# EAGLE schematic Scheffknecht_input_switch (EAGLE 7.7.0)
PROJEKT_NAME: Verstärker_Innovativwoche; SCH_SHEET_NAME: Input switcher; USER_NAME: Scheffknecht/Melcher-Millner
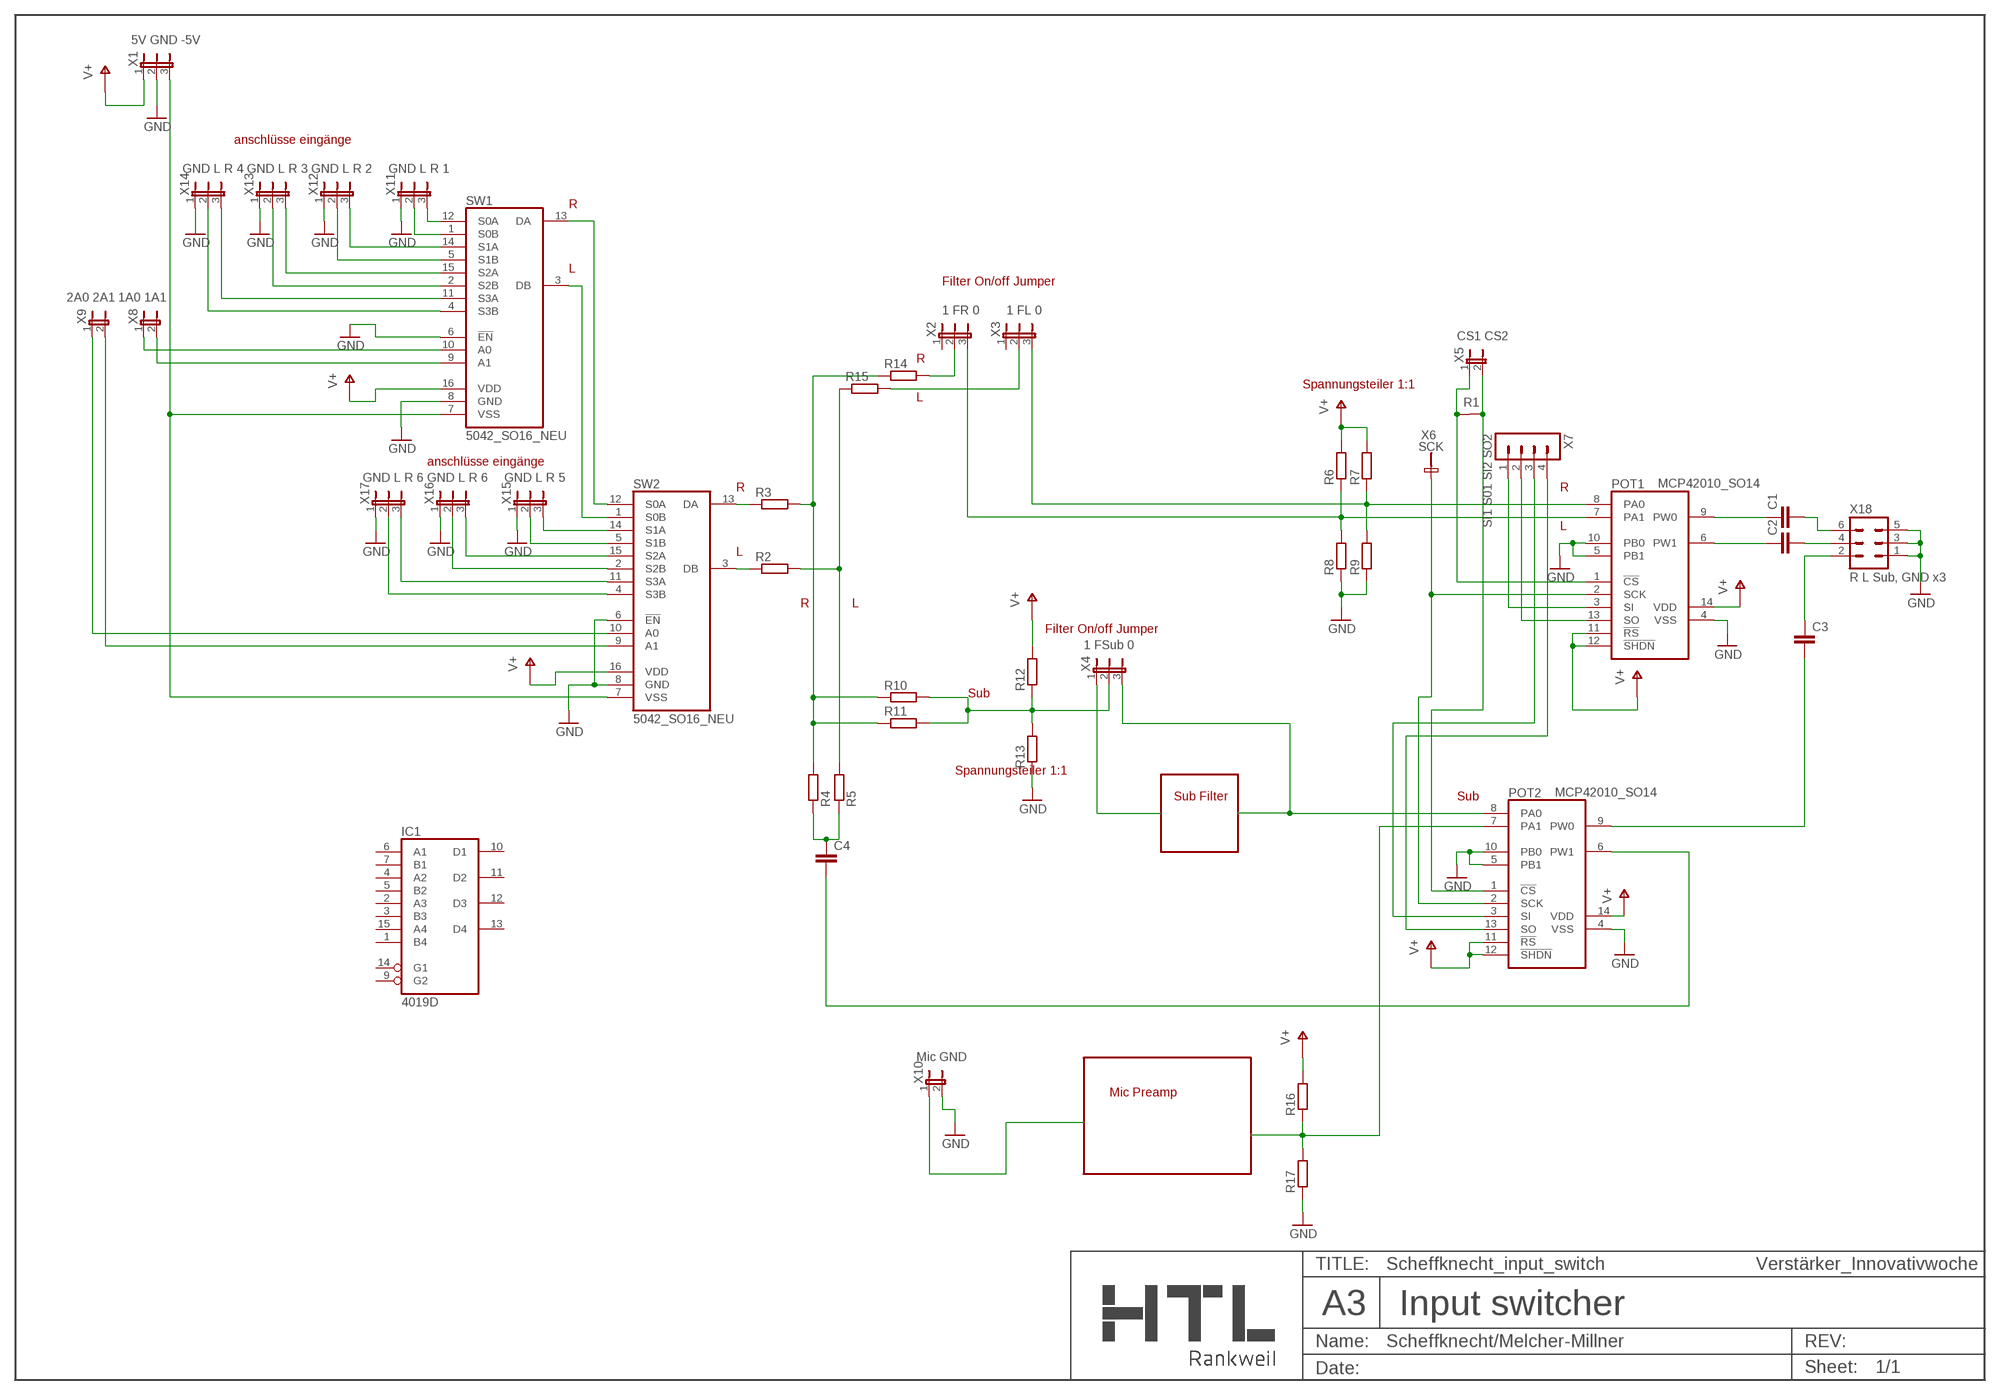
[diagram p0: schematic, sheet 1]

## Parts
C1  C-EUC0805  [C0805]
C2  C-EUC0805  [C0805]
C3  C-EUC0805  [C0805]
C4  C-EUC0805  [C0805]
FRAME1  HTL-A3-H  [HTL-LEER]
IC1  4019D  [SO16]
POT1  MCP42010_SO14  [SO14]
POT2  MCP42010_SO14  [SO14]
R1  R0/10  [R0/10]
R2  R-EU_M0805  [M0805]
R3  R-EU_M0805  [M0805]
R4  R-EU_M0805  [M0805]
R5  R-EU_M0805  [M0805]
R6  R-EU_M0805  [M0805]
R7  R-EU_M0805  [M0805]
R8  R-EU_M0805  [M0805]
R9  R-EU_M0805  [M0805]
R10  R-EU_M0805  [M0805]
R11  R-EU_M0805  [M0805]
R12  R-EU_M0805  [M0805]
R13  R-EU_M0805  [M0805]
R14  R-EU_M0805  [M0805]
R15  R-EU_M0805  [M0805]
R16  R-EU_M0805  [M0805]
R17  R-EU_M0805  [M0805]
SW1  5042_SO16_NEU  [SO-16]
SW2  5042_SO16_NEU  [SO-16]
X1  5V GND -5V  JMP3  [JMP3]
X2  1 FR 0  JMP3  [JMP3]
X3  1 FL 0  JMP3  [JMP3]
X4  1 FSub 0  JMP3  [JMP3]
X5  CS1 CS2  JMP2  [JMP2]
X6  SCK  PIN1  [PIN1]
X7  SI1 S01 SI2 SO2  MA04-1  [MA04-1]
X8  1A0 1A1  JMP2  [JMP2]
X9  2A0 2A1  JMP2  [JMP2]
X10  Mic GND  JMP2  [JMP2]
X11  GND L R 1  JMP3  [JMP3]
X12  GND L R 2  JMP3  [JMP3]
X13  GND L R 3  JMP3  [JMP3]
X14  GND L R 4  JMP3  [JMP3]
X15  GND L R 5  JMP3  [JMP3]
X16  GND L R 6  JMP3  [JMP3]
X17  GND L R 6  JMP3  [JMP3]
X18  R L Sub, GND x3  MA03-2  [MA03-2]

## Nets
GND: POT1.4(VSS) POT1.5(PB1) POT1.10(PB0) POT2.4(VSS) POT2.5(PB1) POT2.10(PB0) R8.1 R9.1 R13.1 R17.1 SW1.6(!EN) SW1.8(GND) SW2.6(!EN) SW2.8(GND) X1.2 X10.2 X11.1 X12.1 X13.1 X14.1 X15.1 X16.1 X17.1 X18.1 X18.3 X18.5
N$1: POT2.1(!CS) R1.2 X5.2
N$2: POT1.1(!CS) R1.1 X5.1
N$3: SW1.3(DB) SW2.1(S0B)
N$4: SW1.13(DA) SW2.12(S0A)
N$5: SW1.9(A1) X8.2
N$6: SW1.10(A0) X8.1
N$7: SW2.9(A1) X9.2
N$8: SW2.10(A0) X9.1
N$10: POT1.3(SI) X7.1
N$11: SW1.7(VSS) SW2.7(VSS) X1.3
N$12: R3.1 SW2.13(DA)
N$13: R2.1 SW2.3(DB)
N$14: R3.2 R4.2 R10.1 R11.1 R14.1
N$15: R2.2 R5.2 R15.1
N$16: C4.1 R4.1 R5.1
N$17: POT1.8(PA0) R7.1 R9.2 X3.3
N$18: C1.1 POT1.9(PW0)
N$20: POT1.7(PA1) R6.1 R8.2 X2.3
N$21: C1.2 X18.6
N$22: R10.2 R11.2 R12.1 R13.2 X4.2
N$23: X4.1
N$24: POT2.8(PA0) X4.3
N$25: C3.2 POT2.9(PW0)
N$26: C2.2 X18.4
N$27: C2.1 POT1.6(PW1)
N$28: C3.1 X18.2
N$31: POT1.13(SO) X7.2
N$32: POT2.3(SI) X7.3
N$33: POT2.13(SO) X7.4
N$34: C4.2 POT2.6(PW1)
N$35: X10.1
N$36: POT2.7(PA1) R16.1 R17.2
N$37: POT1.2(SCK) POT2.2(SCK) X6.P$2(KL1)
N$38: SW1.12(S0A) X11.3
N$39: SW1.1(S0B) X11.2
N$40: SW1.14(S1A) X12.3
N$41: SW1.5(S1B) X12.2
N$42: SW1.15(S2A) X13.3
N$43: SW1.2(S2B) X13.2
N$44: SW1.11(S3A) X14.3
N$45: SW1.4(S3B) X14.2
N$46: SW2.14(S1A) X15.3
N$47: SW2.5(S1B) X15.2
N$48: SW2.15(S2A) X16.3
N$49: SW2.2(S2B) X16.2
N$50: SW2.11(S3A) X17.3
N$51: SW2.4(S3B) X17.2
N$52: R15.2 X3.2
N$53: R14.2 X2.2
V+: POT1.11(!RS) POT1.12(!SHDN) POT1.14(VDD) POT2.11(!RS) POT2.12(!SHDN) POT2.14(VDD) R6.2 R7.2 R12.2 R16.2 SW1.16(VDD) SW2.16(VDD) X1.1
Unconnected: IC1.1(B4) IC1.2(A3) IC1.3(B3) IC1.4(A2) IC1.5(B2) IC1.6(A1) IC1.7(B1) IC1.9(G2) IC1.10(D1) IC1.11(D2) IC1.12(D3) IC1.13(D4) IC1.14(G1) IC1.15(A4) X2.1 X3.1

## Notes on the sheet
- anschlüsse eingänge
- R
- L
- Filter On/off Jumper
- R
- Spannungsteiler 1:1
- L
- anschlüsse eingänge
- R | R
- L
- L
- R | L
- Filter On/off Jumper
- Sub
- Spannungsteiler 1:1
- Sub Filter | Sub
- Mic Preamp

## Power pins joined to a net without a drawn wire
VDD: IC1.16(VDD)
VSS: IC1.8(VSS)

## Library data of the parts
C1-C4 = rcl:C-EU: CAPACITOR, European symbol
FRAME1 = 0_HTL_frame:HTL-A3-H: Arbeitsblatt der HTL Rankweil für Schaltpläne DIN-A3 Landscape kombinierbar mit Boardplänen (CHANGE PACKAGE): DIN-A3 Landscape DIN-A3 Portrait DIN-A4 Landscape DIN-A4 Portrait Leer (für Projekte mit mehreren Schaltplänen und einem Board) Über Attribute werden die Beschriftungeinträge gesteuert: Attribut USER_NAME ( Schaltplan + Board) PROJEKT_NAME ( Schaltplan + Board) ACCOUNT_NAME ( Schaltplan + Board) REVISION ( Schaltplan + Board) SCH_SHEET_NAME ( Schaltplan) BRD_SHEET_NAME ( Board)
IC1 = 40xx:4019: Quad AND-OR select gate
POT1 POT2 = 0_Custom-Lib_Verstärker:MCP42010_SO14
R1 = 0_HTL_analog:R0: Brücke (Symbol horizontal) bedrahtet, SMD
R2-R17 = rcl:R-EU_: RESISTOR, European symbol
SW1 SW2 = 0_Custom-Lib_Verstärker:5042_SO16_NEU
X1-X4 X11-X17 = 0_HTL_elektro:JMP3: Jumper 3-polig
X5 X8-X10 = 0_HTL_elektro:JMP2: Jumper 2-polig
X6 = 0_HTL_uC-MEGACARD:PIN1
X7 = con-lstb:MA04-1: PIN HEADER; OC_FARNELL: unknown; OC_NEWARK: unknown
X18 = con-lstb:MA03-2: PIN HEADER; OC_FARNELL: unknown; OC_NEWARK: unknown